# EAGLE schematic business_card (EAGLE 9.1.3)
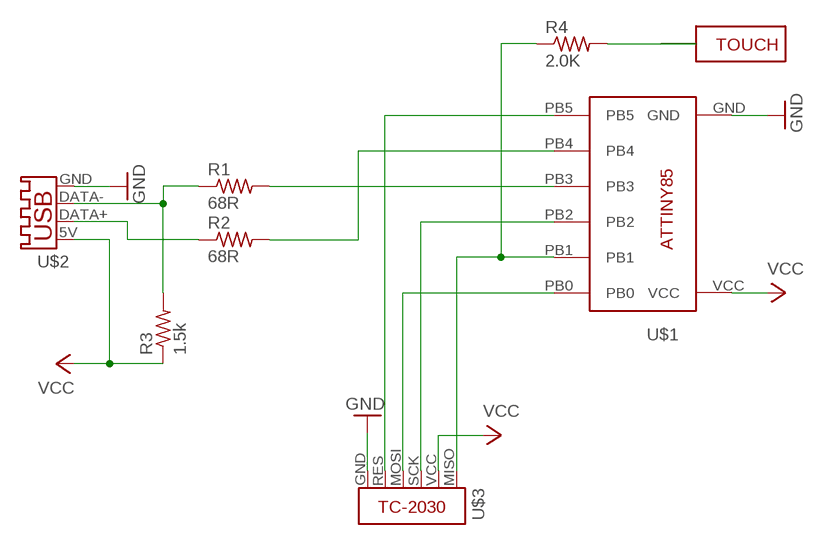
[diagram p0: schematic, sheet 1]

## Parts
R1  68R  0805_RESISTOR  [0805]
R2  68R  0805_RESISTOR  [0805]
R3  1.5k  0805_RESISTOR  [0805]
R4  2.0K  0603_RESISTOR  [0603]
U$1  ATTINY85-20SU  [8SU]
U$2  USB_MALE  [USB_MALE]
U$3  TAG_CONNECT_TC2030  [TC2030-IDC-NL]
U$4  TOUCH_PAD  [SQUARE_PAD]

## Nets
GND: U$1.GND U$2.GND U$3.GND
N$1: R1.P$2 U$1.PB3
N$2: R2.P$2 U$1.PB4
N$3: R1.P$1 R3.P$2 U$2.DATA-(D-)
N$4: R2.P$1 U$2.DATA+(D+)
N$5: R4.IN U$1.PB1 U$3.MISO
N$6: U$1.PB2 U$3.SCK
N$7: U$1.PB0 U$3.MOSI
N$8: U$1.PB5 U$3.RES(RESET)
N$9: R4.OUT U$4.P$1
VCC: R3.P$1 U$1.VCC U$2.5V(VCC) U$3.VCC

## Library data of the parts
R1-R3 = Adam's Parts:0805_RESISTOR
R4 = Adam's Parts:0603_RESISTOR
U$1 = Adam's Parts:ATTINY85-20SU: ATTINY85-20SU surface mounted
U$2 = Adam's Parts:USB_MALE
U$3 = Adam's Parts:TAG_CONNECT_TC2030: Footprint for Tag Connect TC2030-IDC-NL used for JTAG interface
U$4 = Adam's Parts:TOUCH_PAD